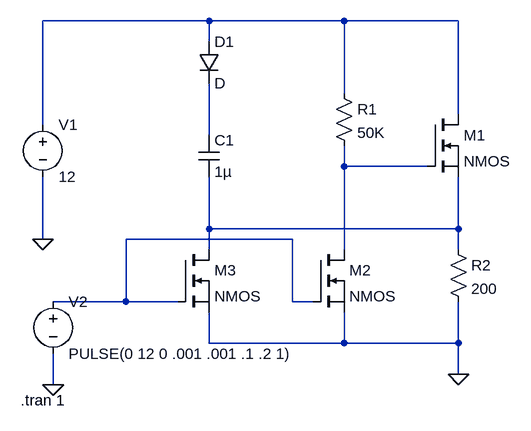
[diagram p0: schematic high_side_driver.asc]
high_side_driver.asc, the LTspice schematic file:
Version 4
SHEET 1 880 712
WIRE -32 112 -288 112
WIRE 176 112 -32 112
WIRE 352 112 176 112
WIRE -32 144 -32 112
WIRE 176 224 176 112
WIRE 352 256 352 112
WIRE -288 272 -288 112
WIRE -32 288 -32 208
WIRE 176 336 176 304
WIRE 304 336 176 336
WIRE -32 432 -32 352
WIRE 352 432 352 352
WIRE 352 432 -32 432
WIRE -288 448 -288 352
WIRE 96 448 -160 448
WIRE -32 464 -32 432
WIRE 176 464 176 336
WIRE 352 464 352 432
WIRE -160 544 -160 448
WIRE -160 544 -272 544
WIRE -80 544 -160 544
WIRE 96 544 96 448
WIRE 128 544 96 544
WIRE -32 608 -32 560
WIRE 176 608 176 560
WIRE 176 608 -32 608
WIRE 352 608 352 544
WIRE 352 608 176 608
WIRE 352 656 352 608
WIRE -272 672 -272 624
FLAG 352 656 0
FLAG -288 448 0
FLAG -272 672 0
SYMBOL diode -48 144 R0
SYMATTR InstName D1
SYMBOL res 160 208 R0
SYMATTR InstName R1
SYMATTR Value 50K
SYMBOL nmos 304 256 R0
SYMATTR InstName M1
SYMBOL nmos 128 464 R0
SYMATTR InstName M2
SYMBOL nmos -80 464 R0
SYMATTR InstName M3
SYMBOL cap -48 288 R0
SYMATTR InstName C1
SYMATTR Value 1µ
SYMBOL res 336 448 R0
SYMATTR InstName R2
SYMATTR Value 200
SYMBOL voltage -288 256 R0
WINDOW 123 0 0 Left 0
WINDOW 39 0 0 Left 0
SYMATTR InstName V1
SYMATTR Value 12
SYMBOL voltage -272 528 R0
WINDOW 123 0 0 Left 0
WINDOW 39 0 0 Left 0
SYMATTR InstName V2
SYMATTR Value PULSE(0 12 0 .001 .001 .1 .2 1)
TEXT -322 696 Left 2 !.tran 1

The netlist it stands for:
* high_side_driver.asc
D1 N001 N002 D
R1 N001 N003 50K
M1 N001 N003 N004 N004 NMOS
M2 N003 N005 0 0 NMOS
M3 N004 N005 0 0 NMOS
C1 N002 N004 1µ
R2 N004 0 200
V1 N001 0 12
V2 N005 0 PULSE(0 12 0 .001 .001 .1 .2 1)
.model D D
.lib standard.dio
.model NMOS NMOS
.model PMOS PMOS
.lib standard.mos
.tran 1
.backanno
.end